# Altium schematic sheet gpio.SchDoc
size A4; SheetNumber: 4; SheetTotal: 8
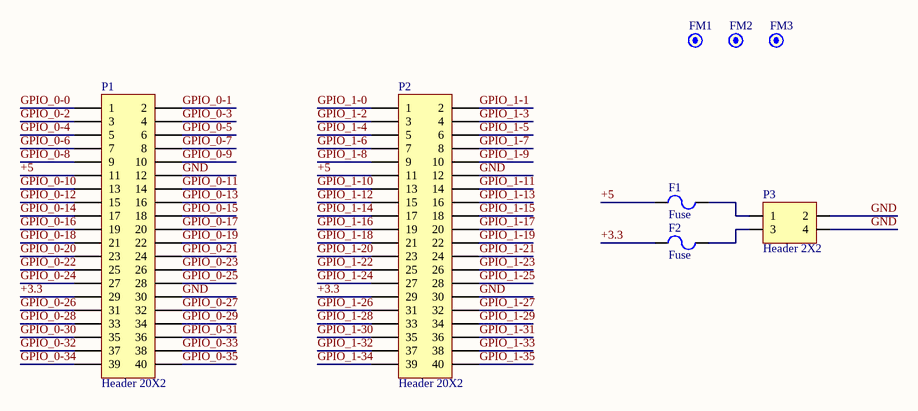
[diagram p0: gpio.SchDoc]

## Parts
F1  Fuse  [Fuse 1206]
F2  Fuse  [Fuse 1206]
FM1  Fiducial  [Fiducial]  (value not drawn)
FM2  Fiducial  [Fiducial]  (value not drawn)
FM3  Fiducial  [Fiducial]  (value not drawn)
P1  Header 20X2  [Header FM 2x20]
P2  Header 20X2  [Header FM 2x20]
P3  Header 2X2  [HDR/Header/4/DL]

## Nets
+3.3: F2.1 P1.29 P2.29
+5: F1.1 P1.11 P2.11
GND: P1.12 P1.30 P2.12 P2.30 P3.2 P3.4
GPIO_0-0: P1.1
GPIO_0-1: P1.2
GPIO_0-2: P1.3
GPIO_0-3: P1.4
GPIO_0-4: P1.5
GPIO_0-5: P1.6
GPIO_0-6: P1.7
GPIO_0-7: P1.8
GPIO_0-8: P1.9
GPIO_0-9: P1.10
GPIO_0-10: P1.13
GPIO_0-11: P1.14
GPIO_0-12: P1.15
GPIO_0-13: P1.16
GPIO_0-14: P1.17
GPIO_0-15: P1.18
GPIO_0-16: P1.19
GPIO_0-17: P1.20
GPIO_0-18: P1.21
GPIO_0-19: P1.22
GPIO_0-20: P1.23
GPIO_0-21: P1.24
GPIO_0-22: P1.25
GPIO_0-23: P1.26
GPIO_0-24: P1.27
GPIO_0-25: P1.28
GPIO_0-26: P1.31
GPIO_0-27: P1.32
GPIO_0-28: P1.33
GPIO_0-29: P1.34
GPIO_0-30: P1.35
GPIO_0-31: P1.36
GPIO_0-32: P1.37
GPIO_0-33: P1.38
GPIO_0-34: P1.39
GPIO_0-35: P1.40
GPIO_1-0: P2.1
GPIO_1-1: P2.2
GPIO_1-2: P2.3
GPIO_1-3: P2.4
GPIO_1-4: P2.5
GPIO_1-5: P2.6
GPIO_1-6: P2.7
GPIO_1-7: P2.8
GPIO_1-8: P2.9
GPIO_1-9: P2.10
GPIO_1-10: P2.13
GPIO_1-11: P2.14
GPIO_1-12: P2.15
GPIO_1-13: P2.16
GPIO_1-14: P2.17
GPIO_1-15: P2.18
GPIO_1-16: P2.19
GPIO_1-17: P2.20
GPIO_1-18: P2.21
GPIO_1-19: P2.22
GPIO_1-20: P2.23
GPIO_1-21: P2.24
GPIO_1-22: P2.25
GPIO_1-23: P2.26
GPIO_1-24: P2.27
GPIO_1-25: P2.28
GPIO_1-26: P2.31
GPIO_1-27: P2.32
GPIO_1-28: P2.33
GPIO_1-29: P2.34
GPIO_1-30: P2.35
GPIO_1-31: P2.36
GPIO_1-32: P2.37
GPIO_1-33: P2.38
GPIO_1-34: P2.39
GPIO_1-35: P2.40
NetF1_2: F1.2 P3.1
NetF2_2: F2.2 P3.3

## Library data of the parts
FM1-FM3 = Fiducial: Fiducial Marker
P1 P2 = Header 20X2: Header, 20-Pin, Dual row; LatestRevisionDate: 17-Jul-2002; LatestRevisionNote: Re-released for DXP Platform.; Publisher: Altium Limited
P3 = Header 2X2: Header, 2-Pin, Dual row